# EAGLE design ctrl (EAGLE 5.07)
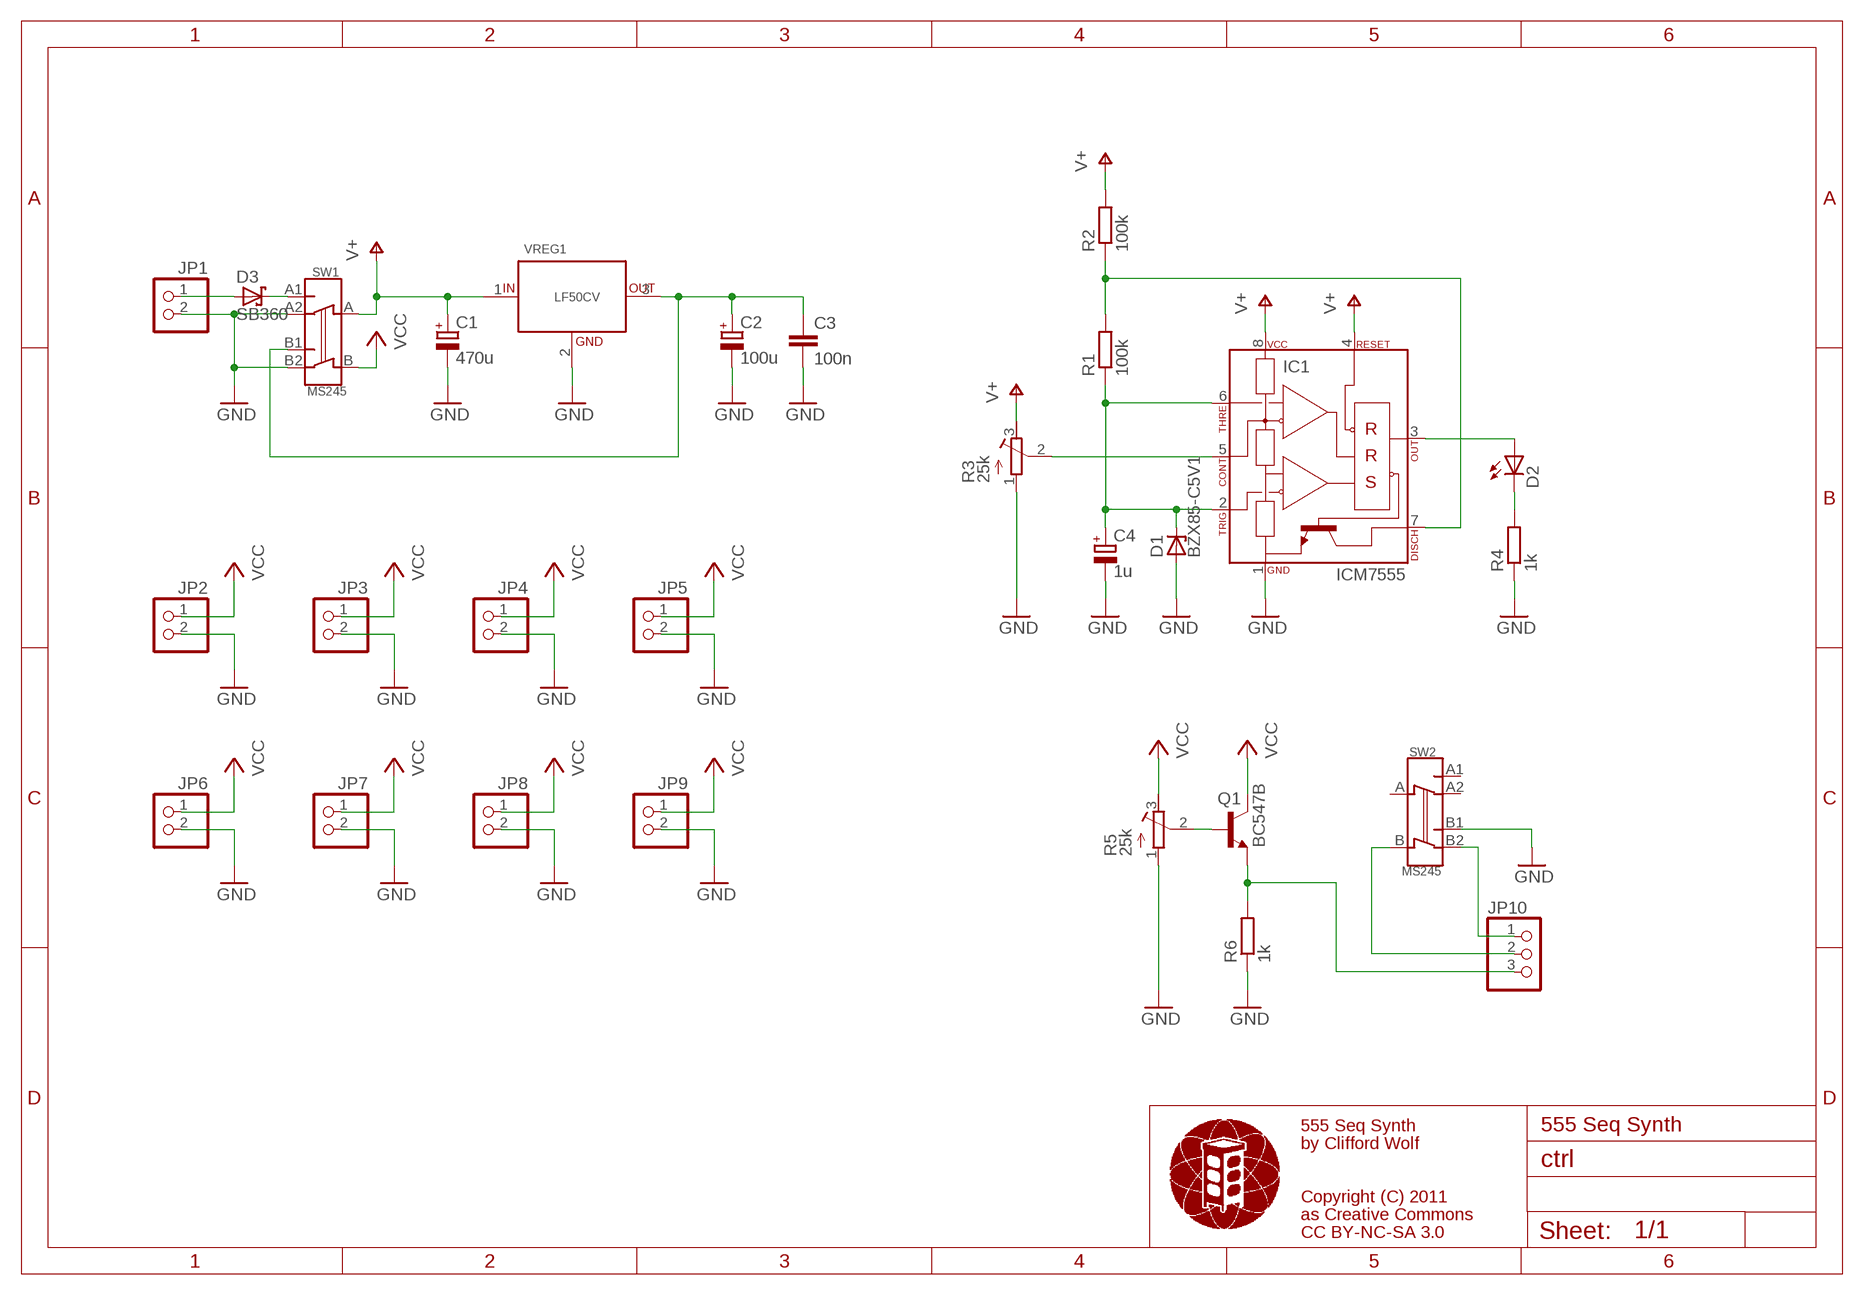
[diagram p0: schematic, sheet 1]

## Parts
C1  470u  CPOLE5-10,5L  [E5-10,5L]
C2  100u  CPOLE5-10,5L  [E5-10,5L]
C3  100n  C050-030X075  [C050-030X075]
C4  1u  CPOLE2-5L  [E2-5L]
D1  BZX85-C5V1  [DO41Z10]
D2  LED5MM  [LED5MM]
D3  SB360  [DO201T15]
IC1  ICM7555  [DIL08]
JP1  PINHD-1X2  [1X02]
JP2  PINHD-1X2  [1X02]
JP3  PINHD-1X2  [1X02]
JP4  PINHD-1X2  [1X02]
JP5  PINHD-1X2  [1X02]
JP6  PINHD-1X2  [1X02]
JP7  PINHD-1X2  [1X02]
JP8  PINHD-1X2  [1X02]
JP9  PINHD-1X2  [1X02]
JP10  PINHD-1X3  [1X03]
Q1  BC547B  [TO92]
R1  100k  R0309/10  [0309/10]
R2  100k  R0309/10  [0309/10]
R3  25k  R-TRIMMRK09K113  [ALPS_RK09K113]
R4  1k  R0309/10  [0309/10]
R5  25k  R-TRIMMRK09K113  [ALPS_RK09K113]
R6  1k  R0309/10  [0309/10]
SW1  MS245  [MS245]
SW2  MS245  [MS245]
VREG1  LF50CV  [TO220]

## Nets
GND [pwr]: C1.- C2.- C3.2 C4.- D1.A IC1.1(GND) JP1.2 JP2.2 JP3.2 JP4.2 JP5.2 JP6.2 JP7.2 JP8.2 JP9.2 R3.1(E) R4.1 R5.1(E) R6.1 SW1.A2 SW1.B2 SW2.B1 VREG1.2(GND)
N$1: IC1.7(DISCH) R1.2 R2.1
N$2 [pwr]: D3.A JP1.1
N$3: C4.+ D1.C IC1.2(TRIG) IC1.6(THRESH) R1.1
N$4: IC1.5(CONT) R3.2(S)
N$5: D2.A IC1.3(OUT)
N$6: D2.K(C) R4.2
N$7 [pwr]: C2.+ C3.1 SW1.B1 VREG1.3(OUT)
N$8 [pwr]: D3.C SW1.A1
N$9: Q1.2(B) R5.2(S)
N$10: JP10.3 Q1.1(E) R6.2
N$11: JP10.1 SW2.B2
N$12: JP10.2 SW2.B
V+ [pwr]: C1.+ IC1.4(RESET) IC1.8(VCC) R2.2 R3.3(A) SW1.A VREG1.1(IN)
VCC [pwr]: JP2.1 JP3.1 JP4.1 JP5.1 JP6.1 JP7.1 JP8.1 JP9.1 Q1.3(C) R5.3(A) SW1.B
Unconnected: SW2.A SW2.A1 SW2.A2

## Notes on the sheet
- 555 Seq Synth | 555 Seq Synth
- by Clifford Wolf
- Copyright (C) 2011
- as Creative Commons
- CC BY-NC-SA 3.0

## Library data of the parts
C1 C2 C4 = mp_passive:CPOL: POLARIZED CAPACITOR, European symbol
C3 = mp_passive:C: CAPACITOR, European symbol
D1 = mp_diode:BZX85-C5V1: Z DIODE (5.1 V)
D2 = mp_diode:LED: LED (5mm)
D3 = mp_diode:SB360: Power Schottky Diode
IC1 = mp_miscic:ICM7555: ICM7555 universal RC timer
JP1-JP9 = mpc_pinhead:PINHD-1X2: PIN HEADER
JP10 = mpc_pinhead:PINHD-1X3: PIN HEADER
Q1 = mp_transistor:BC547B: NPN Transistor
R1 R2 R4 R6 = mp_passive:R: RESISTOR, European symbol
R3 R5 = mp_switch:R-TRIMM: Trimm resistor
SW1 SW2 = mp_switch:MS245: MIYAMA MS 245
VREG1 = mp_vreg:LF50CV: LF50CV Low Drop 5.0V Voltage Regulator

## Net classes
1 pwr: width 0.762 mm

## Board
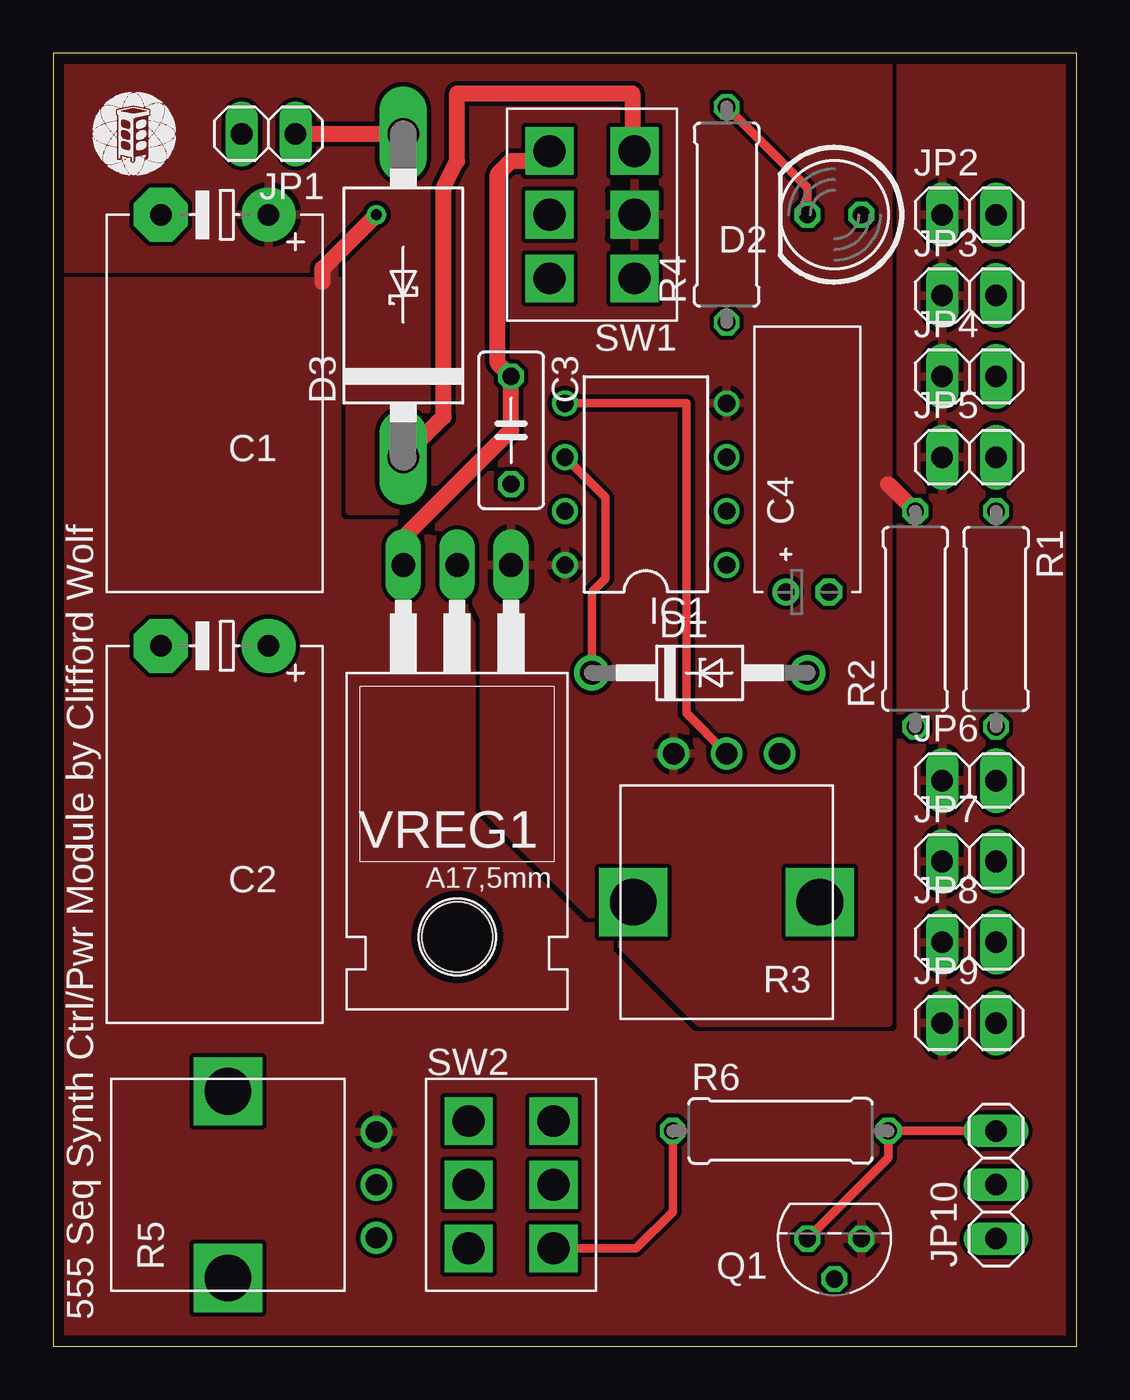
[diagram p1: board, top side]
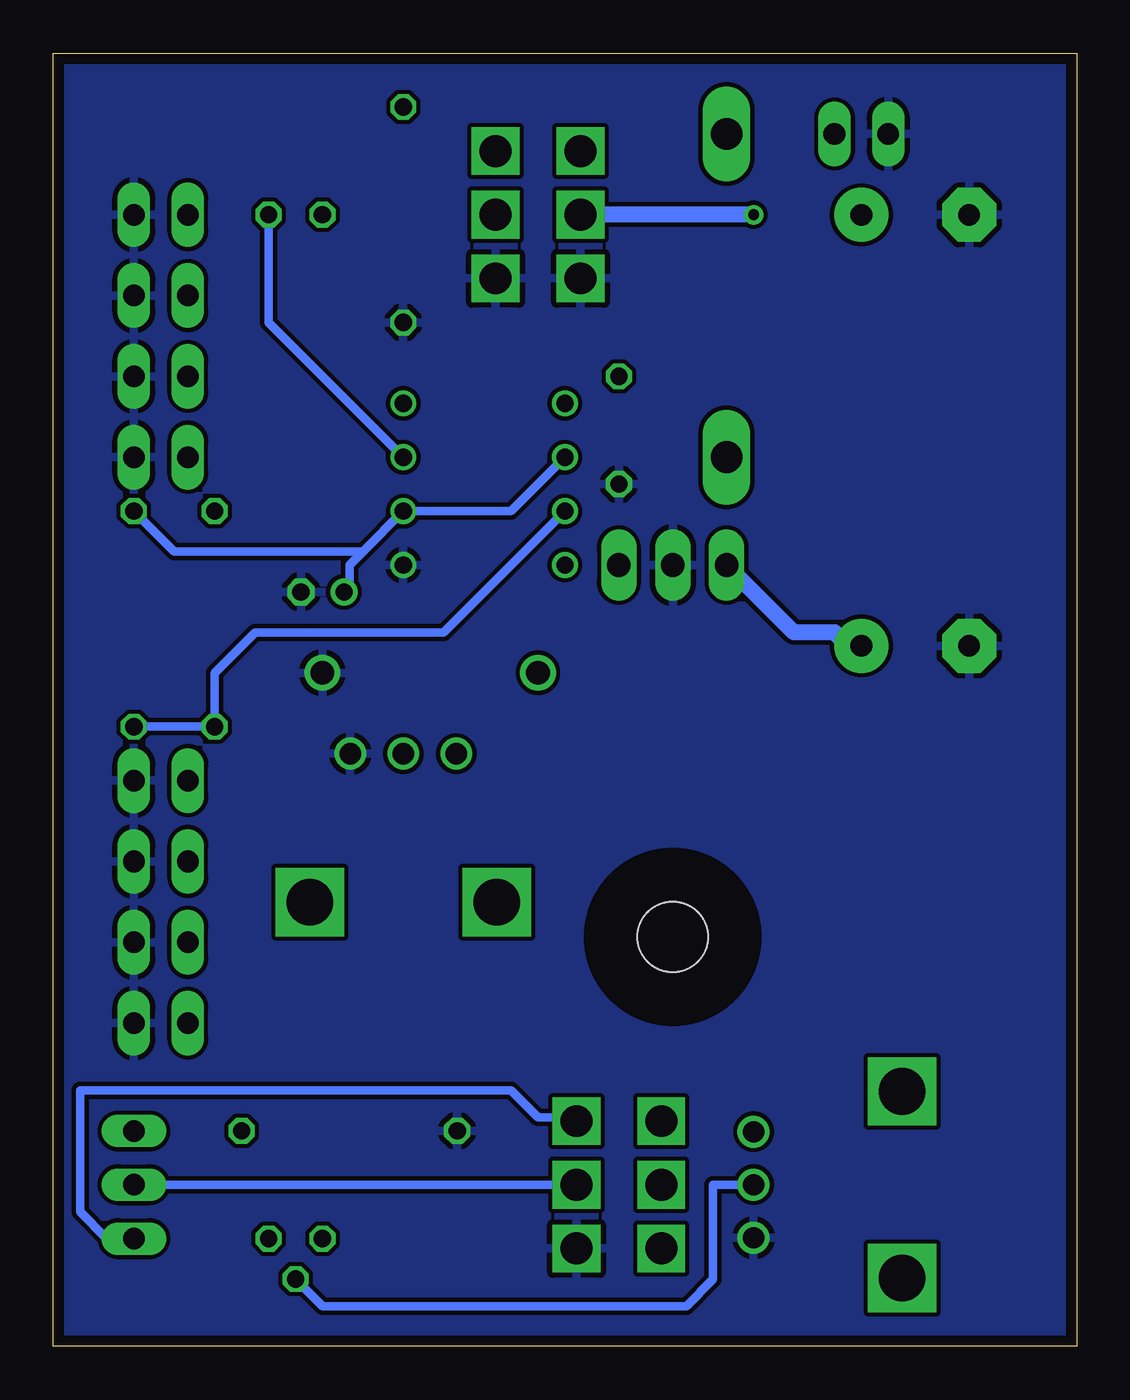
[diagram p2: board, bottom side, seen from below]

Size 48.26 x 60.96 mm. Coordinates in mm from the lower left corner, seen from the top.
Outline: 0,0 48.26,0 48.26,60.96 0,60.96 0,0
Copper layers (1*16): Top 0.035mm / dielectric 1.5mm / Bottom 0.035mm
Design rules "qprules_8mil *": minimum track width 16mil, minimum drill 20mil, track to track 8mil, track to pad 8mil, pad to pad 8mil, via to via 8mil, smd to smd 8mil, copper to edge 20mil, drill to drill 20mil, minimum pad ring 8mil, minimum via ring 8mil, stop-mask expansion 0mil, vias tented up to drill 0mil, thermal gap 10mil

### Footprints (pad centres in the part's own frame; a part is rotated, then mirrored left to right if it is on the bottom)
E5-10,5L = drill 1.016 pad 2.54 round: + -2.54,0 | drill 1.016 pad 2.54 octagon: - 2.54,0
C050-030X075 = drill 0.813 octagon: 1 -2.54,0; 2 2.54,0
E2-5L = drill 0.813 pad 1.27 round: + -1.016,0 | drill 0.813 pad 1.27 octagon: - 1.016,0
DO41Z10 = drill 1.118 round: A 5.08,0; C -5.08,0
LED5MM = drill 0.813 octagon: A -1.27,0; K 1.27,0
DO201T15 = drill 1.499 long: A 7.62,0; C -7.62,0
DIL08 = drill 0.813 round: 1 -3.81,-3.81; 2 -1.27,-3.81; 3 1.27,-3.81; 4 3.81,-3.81; 5 3.81,3.81; 6 1.27,3.81; 7 -1.27,3.81; 8 -3.81,3.81
1X02 = drill 1.016 long: 1 -1.27,0; 2 1.27,0
1X03 = drill 1.016 long: 1 -2.54,0; 2 0,0; 3 2.54,0
TO92 = drill 0.813 octagon: 1 1.27,0; 2 0,1.905; 3 -1.27,0
0309/10 = drill 0.813 octagon: 1 -5.08,0; 2 5.08,0
ALPS_RK09K113 = drill 1 round: 1 -2.5,0; 2 0,0; 3 2.5,0 | drill 2.2 square: NC1 -4.4,7; NC2 4.4,7
MS245 = drill 1.5 square: A -2,0; A1 -2,-3; A2 -2,3; B 2,0; B1 2,-3; B2 2,3
TO220 = drill 1.118 long: 1 -2.54,-6.35; 2 0,-6.35; 3 2.54,-6.35 | hole 3.302: 0,11.176

### Placement (x,y rotation side)
C1  7.62,53.34 180 top
C2  7.62,33.02 180 top
C3  21.59,43.18 270 top
C4  35.56,35.56 0 top
D1  30.48,31.75 0 top
D2  36.83,53.34 180 top
D3  16.51,49.53 90 top
IC1  27.94,40.64 90 top
JP1  10.16,57.15 180 top
JP2  43.18,53.34 0 top
JP3  43.18,49.53 0 top
JP4  43.18,45.72 0 top
JP5  43.18,41.91 0 top
JP6  43.18,26.67 0 top
JP7  43.18,22.86 0 top
JP8  43.18,19.05 0 top
JP9  43.18,15.24 0 top
JP10  44.45,7.62 90 top
Q1  36.83,5.08 180 top
R1  44.45,34.29 270 top
R2  40.64,34.29 90 top
R3  31.75,27.94 180 top
R4  31.75,53.34 90 top
R5  15.24,7.62 90 top
R6  34.29,10.16 0 top
SW1  25.4,53.34 180 top
SW2  21.59,7.62 0 top
U$1  [METALAB_SMALL]  3.81,57.15 0 top
VREG1  19.05,30.48 180 top

### Tracks (layer width: path | path; a pad name or v marks a point on that pad's centre or on a via)
GND
  Top 0.406: SW2.B1 27.48,4.62 29.21,6.35 R6.1
  pour Bottom: 0,60.96 48.26,60.96 48.26,0 0,0
N$1
  Bottom 0.406: IC1.7 29.84,33.66 38.73,33.66 40.64,31.75 R2.1 R1.2
N$2
  Top 0.762: JP1.1 D3.A
N$3
  Top 0.406: D1.C 25.4,35.56 26.04,36.2 26.04,40.01 IC1.6
  Bottom 0.406: 33.66,37.47 34.29,36.83 34.29,35.56 C4.+ | 33.66,37.47 IC1.2 26.67,39.37 IC1.6 | R1.1 42.55,37.47 33.66,37.47
N$4
  Top 0.406: IC1.5 29.84,44.45 29.84,29.84 R3.2
N$5
  Bottom 0.406: IC1.3 38.1,48.26 D2.A
N$6
  Top 0.406: R4.2 35.56,54.61 D2.K
N$7
  Top 0.762: SW1.B1 22.86,55.88 21.59,55.88 20.95,55.24 20.95,46.35 C3.1 21.59,43.18 16.51,38.1 VREG1.3
  Bottom 0.762: VREG1.3 13.34,33.66 11.43,33.66 10.79,33.02 C2.+
N$8
  Top 0.762: D3.C 18.41,43.81 18.41,54.61 19.05,55.88 19.05,59.05 27.3,59.05 27.3,56.52 SW1.A1
N$9
  Bottom 0.406: Q1.2 35.56,1.91 18.41,1.91 17.14,3.17 17.14,7.62 R5.2
N$10
  Top 0.406: Q1.1 39.37,8.89 R6.2 JP10.3
N$11
  Bottom 0.406: SW2.B2 24.13,10.79 25.4,10.79 26.67,12.06 46.99,12.06 46.99,6.35 45.72,5.08 JP10.1
N$12
  Bottom 0.406: SW2.B JP10.2
V+
  Top 0.762: R2.2 39.37,40.64
  pour Top: 0,60.96 0,50.8 13.97,50.8 13.97,39.37 17.78,39.37 20.32,34.29 20.32,25.4 30.48,15.24 39.37,15.24 39.37,60.96
VCC  (via drill 0.51)
  Top 0.762: v15.24,53.34 12.7,50.8 12.7,50.16
  Bottom 0.762: v15.24,53.34 SW1.B
  pour Top (rank 2): 0,60.96 48.26,60.96 48.26,0 0,0

### Text on the board
tPlace: 555 Seq Synth Ctrl/Pwr Module by Clifford Wolf